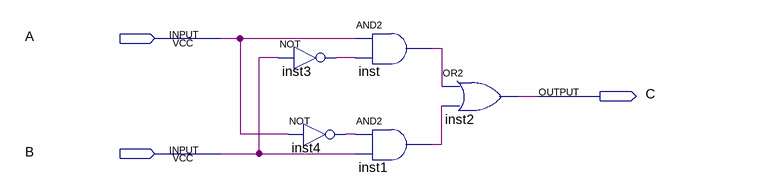
[diagram p0: schematic sheet]
// Quartus schematic my_xor_sop_sch.bdf as structural Verilog: 5 symbols, 3 pins
module my_xor_sop_sch (
  input  A,
  input  B,
  output C
);

  wire inst1_out, inst3_out, inst4_out, inst_out;

  not inst3 (inst3_out, B);
  not inst4 (inst4_out, A);
  and inst (inst_out, A, inst3_out);
  and inst1 (inst1_out, inst4_out, B);
  or inst2 (C, inst_out, inst1_out);
endmodule
